# Altium schematic sheet mix_conn.SchDoc: mcHF Pro Transceiver UI board
size A3; Author: Krassi Atanassov; CompanyName: MØNKA; Engineer: For radio amateurs experimentation, non-commercial use only. Thank you!; Revision: 0.8.2; SheetTotal: 18
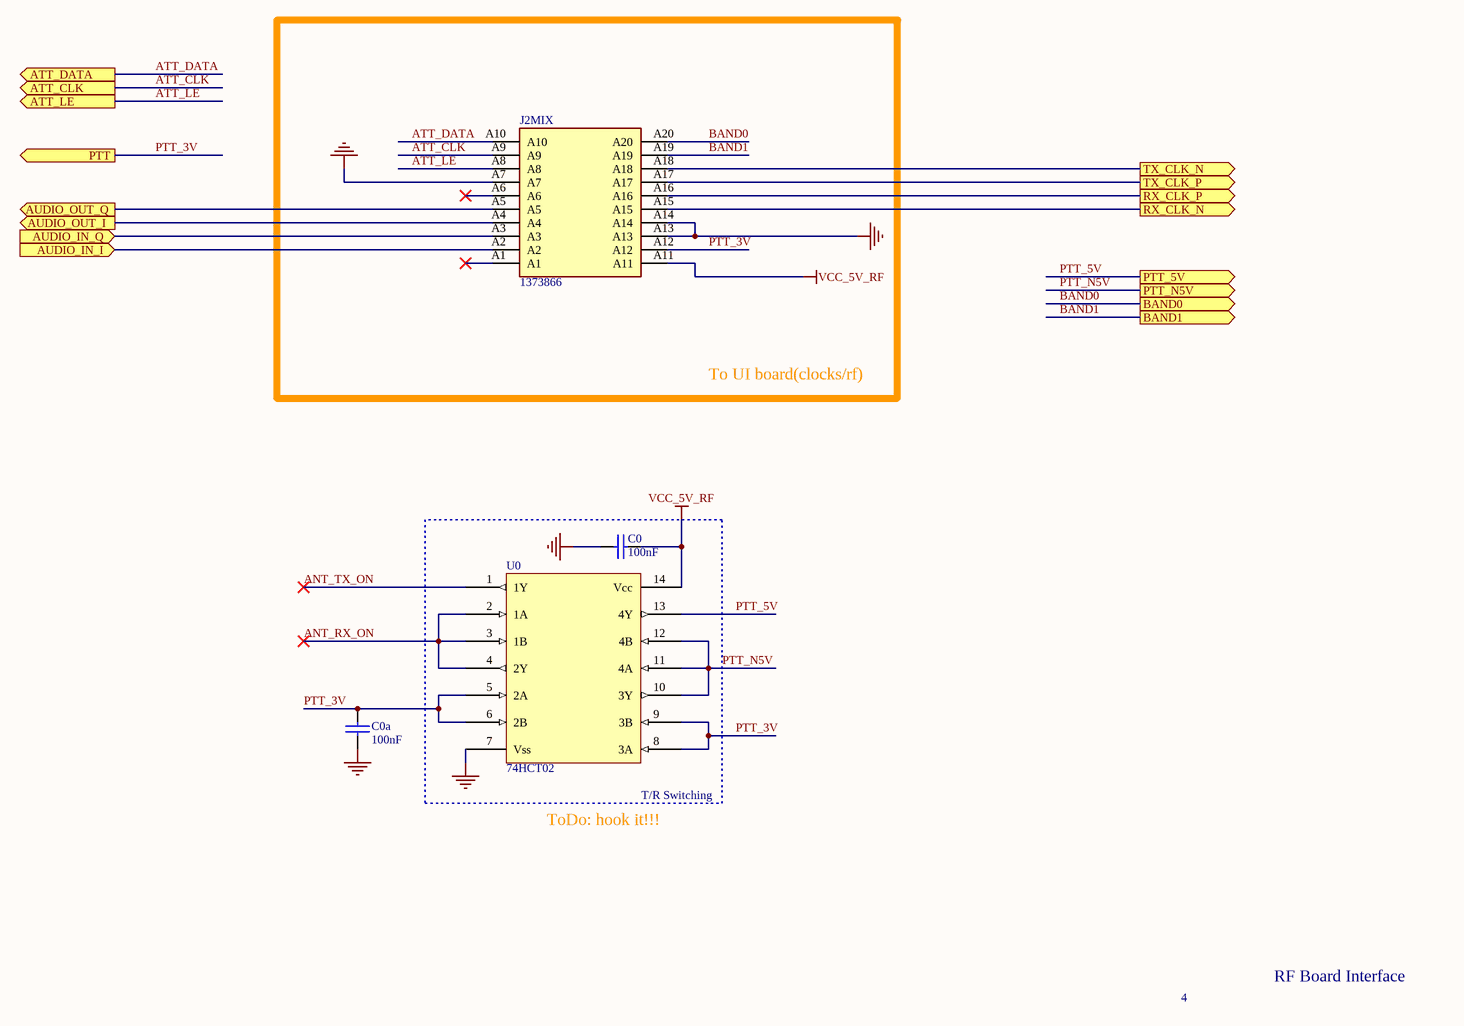
[diagram p0: mix_conn.SchDoc]

## Parts
C0  100nF  [0805]
C0a  100nF  [0805]
J2MIX  1373866  [YuanQi4mm]
U0  74HCT02  [SO-14]

## Blocks framed on the sheet
To UI board(clocks/rf): J2MIX
T/R Switching: C0 U0

## Ports
ATT_CLK (out), ATT_DATA (out), ATT_LE (out), AUDIO_IN_I (in), AUDIO_IN_Q (in), AUDIO_OUT_I (out), AUDIO_OUT_Q (out), BAND0 (out), BAND1 (out), PTT (out), PTT_5V (out), PTT_N5V (out), RX_CLK_N (out), RX_CLK_P (out), TX_CLK_N (out), TX_CLK_P (out)

## Nets
GND: C0.2 C0a.2 J2MIX.A7 J2MIX.A13 J2MIX.A14 U0.7(Vss)
VCC_5V_RF: C0.1 J2MIX.A11 U0.14(Vcc)
ANT_RX_ON: U0.2(1A) U0.3(1B) U0.4(2Y)
ANT_TX_ON: U0.1(1Y)
ATT_CLK: J2MIX.A9 ; port ATT_CLK
ATT_DATA: J2MIX.A10 ; port ATT_DATA
ATT_LE: J2MIX.A8 ; port ATT_LE
AUDIO_IN_I: J2MIX.A2 ; port AUDIO_IN_I
AUDIO_IN_Q: J2MIX.A3 ; port AUDIO_IN_Q
AUDIO_OUT_I: J2MIX.A4 ; port AUDIO_OUT_I
AUDIO_OUT_Q: J2MIX.A5 ; port AUDIO_OUT_Q
BAND0: J2MIX.A20 ; port BAND0
BAND1: J2MIX.A19 ; port BAND1
PTT_3V: C0a.1 J2MIX.A12 U0.5(2A) U0.6(2B) U0.8(3A) U0.9(3B) ; port PTT
PTT_5V: U0.13(4Y) ; port PTT_5V
PTT_N5V: U0.10(3Y) U0.11(4A) U0.12(4B) ; port PTT_N5V
RX_CLK_N: J2MIX.A15 ; port RX_CLK_N
RX_CLK_P: J2MIX.A16 ; port RX_CLK_P
TX_CLK_N: J2MIX.A18 ; port TX_CLK_N
TX_CLK_P: J2MIX.A17 ; port TX_CLK_P

Not connected (* = marked no-connect by the designer): J2MIX A1* A6*

## Notes on the sheet
- ToDo: hook it!!!
- 4
- RF Board Interface
- Date:
- File:
- Revision:
- Sheet
- of
- License:

## Library data of the parts
C0 C0a = CAP: Capacitor; QT Order: QCC-00154; Price: 0.068
J2MIX = YQ_20p: SMD male connector, nominal current: 2.2 A, Test voltage: 840 VAC, number of positions: 20, pitch: 1.27 mm, color: black, contact surface: Gold, type of contact: Male connector, mounting: SMD soldering; Manufacturer_Name: Phoenix Contact; Geometry.Height: 6.75mm; Mouser Part Number: 651-1373866; Mouser Price/Stock: https://www.mouser.co.uk/ProductDetail/Phoenix-Contact/1373866?qs=2SLPxufLcgAs0enIXKjUUw%3D%3D; Manufacturer_Part_Number: 1373866; Datasheet Link: http://www.phoenixcontact.com/gb/produkte/1373866
U0 = 74HCT02: Quad 2-input NOR gate; QT Order: QCI-01079; Price: 0.38